# Altium schematic sheet Main_sch.SchDoc: Main_sch
size A3; Date: 2018/10/8; Author: Wang Peirong; Revision: V1.1; SheetNumber: 1; SheetTotal: Main schDoc; Size: A3; Pages: 6
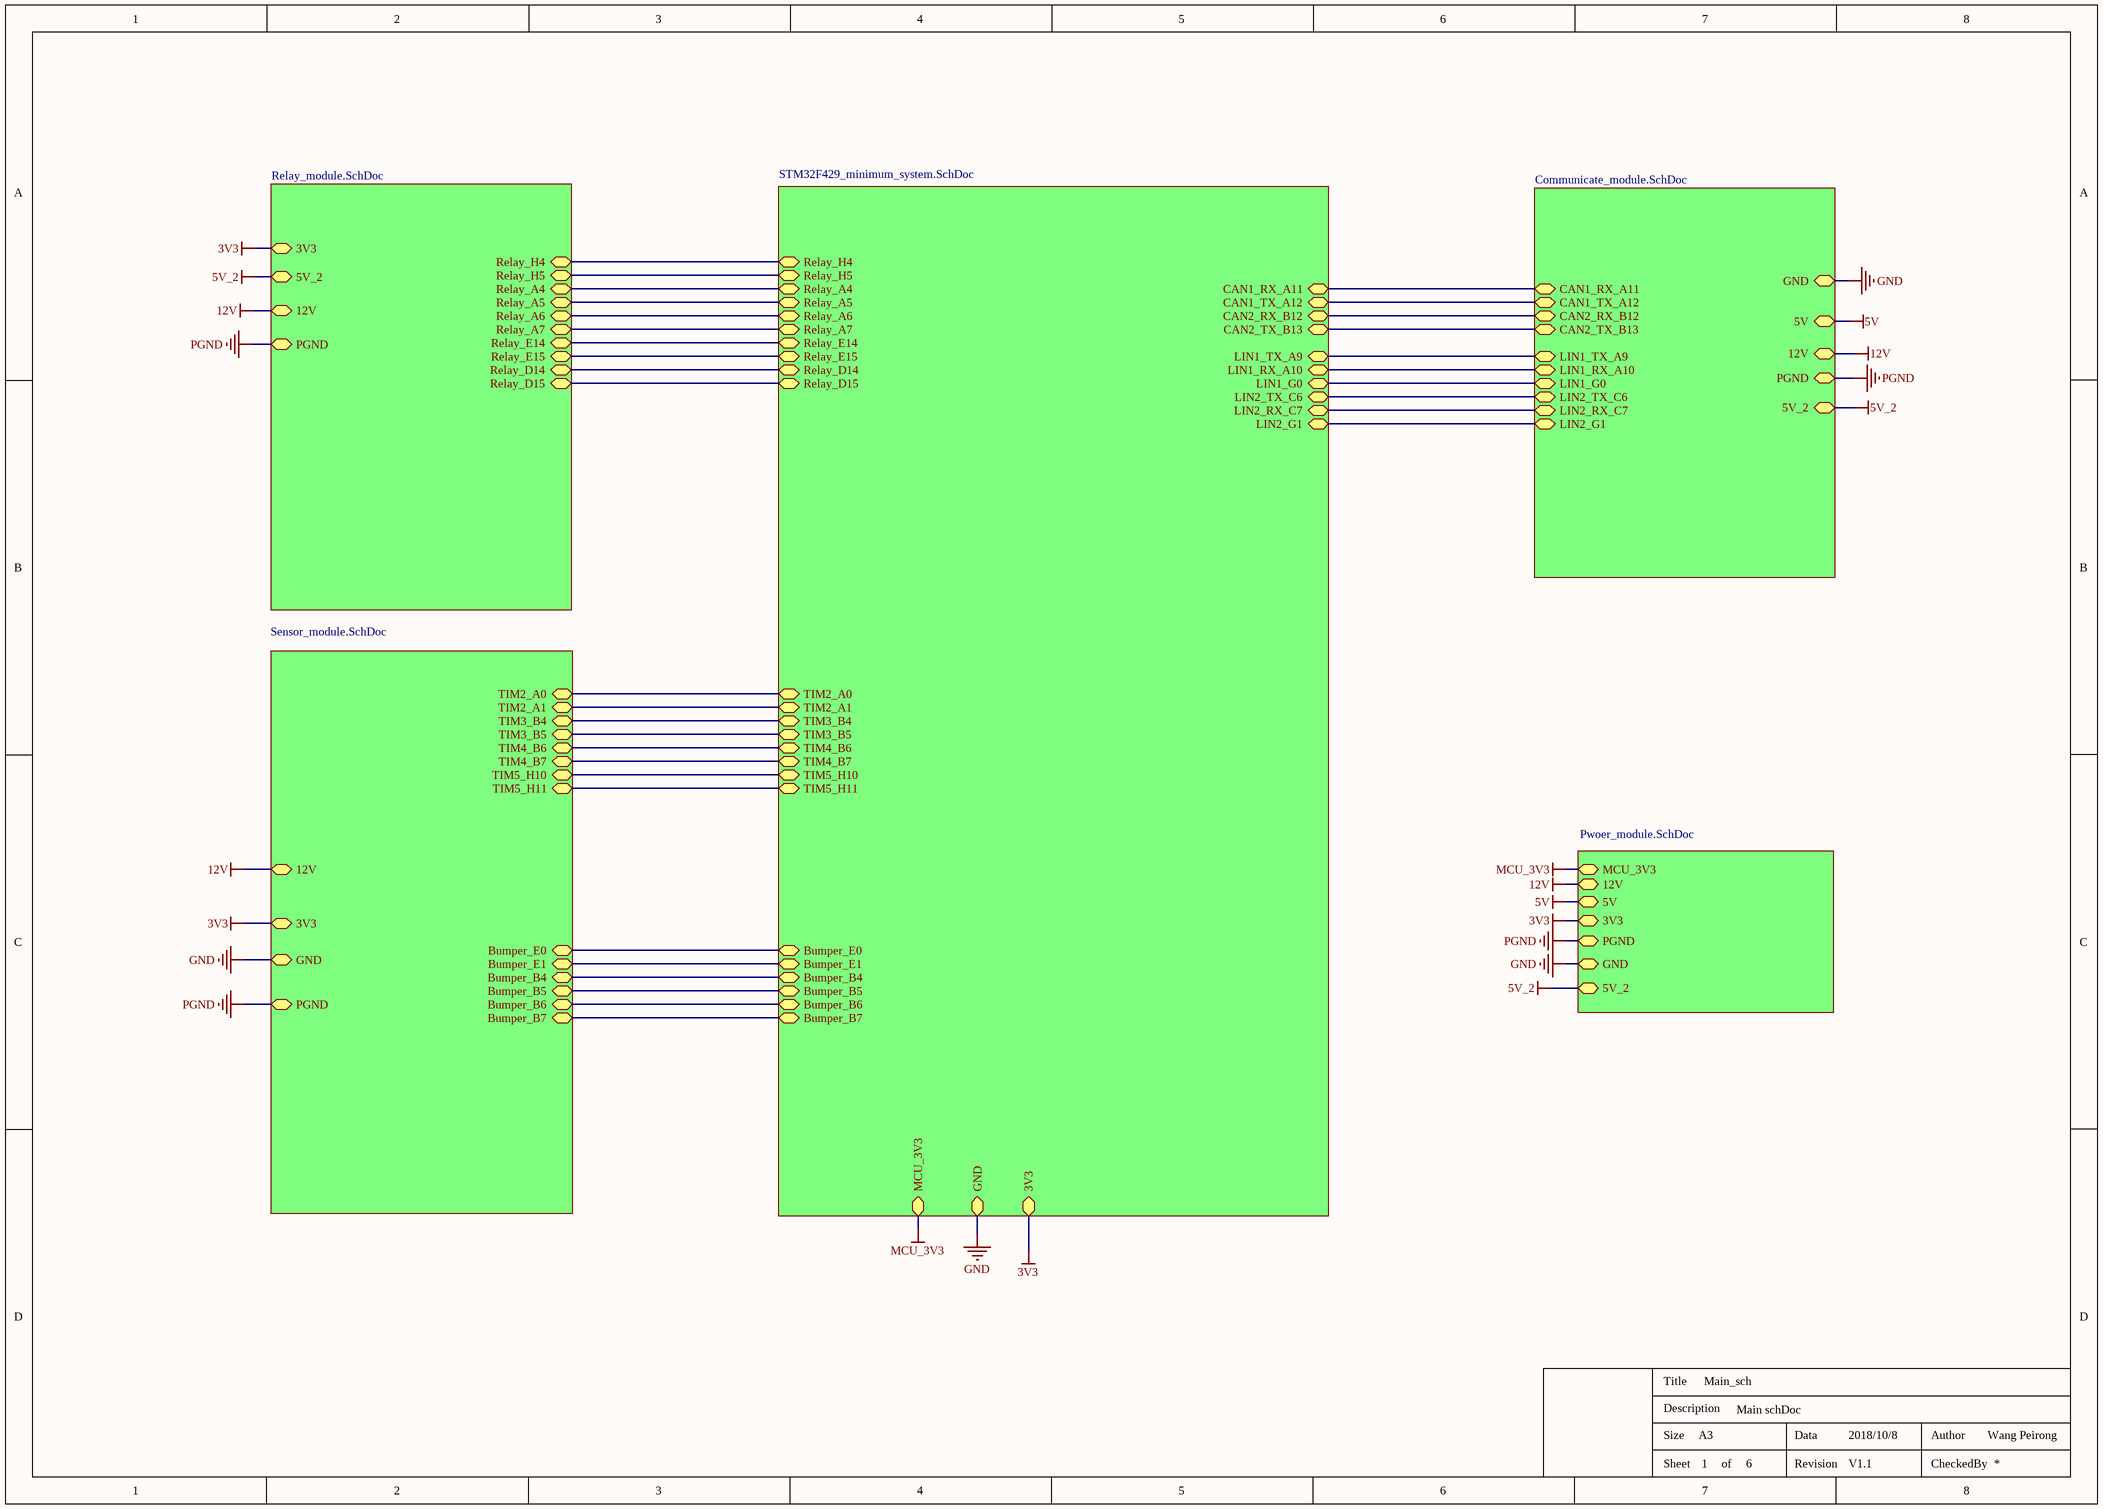
[diagram p0: Main_sch.SchDoc]

## Sub-sheets
? = Pwoer_module.SchDoc: 3V3, 12V, 5V, GND, PGND, 5V_2, MCU_3V3
? = Sensor_module.SchDoc: 12V, 3V3, GND, PGND, TIM2_A0, TIM2_A1, TIM3_B4, TIM3_B5, TIM4_B6, TIM4_B7, TIM5_H10, TIM5_H11, Bumper_E0, Bumper_E1, Bumper_B4, Bumper_B5, Bumper_B6, Bumper_B7
? = STM32F429_minimum_system.SchDoc: MCU_3V3, GND, CAN2_RX_B12, CAN2_TX_B13, CAN1_RX_A11, CAN1_TX_A12, TIM2_A0, TIM2_A1, TIM3_B4, TIM3_B5, TIM4_B6, TIM4_B7, TIM5_H10, TIM5_H11, Bumper_E0, Bumper_E1, Bumper_B4, Bumper_B5, Bumper_B6, Bumper_B7, Relay_H4, Relay_H5, Relay_A4, Relay_A5, Relay_A6, Relay_A7, Relay_E14, Relay_E15, LIN1_TX_A9, LIN1_RX_A10, LIN1_G0, LIN2_G1, LIN2_RX_C7, LIN2_TX_C6, Relay_D14, Relay_D15, 3V3
? = Relay_module.SchDoc: 3V3, 5V_2, 12V, PGND, Relay_H4, Relay_H5, Relay_A4, Relay_A5, Relay_A6, Relay_A7, Relay_E14, Relay_E15, Relay_D14, Relay_D15
? = Communicate_module.SchDoc: GND, 5V, CAN1_RX_A11, CAN1_TX_A12, CAN2_RX_B12, CAN2_TX_B13, 12V, PGND, LIN1_TX_A9, LIN1_RX_A10, 5V_2, LIN2_G1, LIN1_G0, LIN2_RX_C7, LIN2_TX_C6

## Nets
3V3: sheet /3V3, sheet /3V3, sheet /3V3, sheet /3V3
5V: sheet /5V, sheet /5V
5V_2: sheet /5V_2, sheet /5V_2, sheet /5V_2
12V: sheet /12V, sheet /12V, sheet /12V, sheet /12V
GND: sheet /GND, sheet /GND, sheet /GND, sheet /GND
MCU_3V3: sheet /MCU_3V3, sheet /MCU_3V3
PGND: sheet /PGND, sheet /PGND, sheet /PGND, sheet /PGND
(unnamed): sheet /TIM2_A0, sheet /TIM2_A0
(unnamed): sheet /TIM2_A1, sheet /TIM2_A1
(unnamed): sheet /TIM3_B4, sheet /TIM3_B4
(unnamed): sheet /TIM3_B5, sheet /TIM3_B5
(unnamed): sheet /TIM4_B6, sheet /TIM4_B6
(unnamed): sheet /TIM4_B7, sheet /TIM4_B7
(unnamed): sheet /TIM5_H10, sheet /TIM5_H10
(unnamed): sheet /TIM5_H11, sheet /TIM5_H11
(unnamed): sheet /Bumper_E0, sheet /Bumper_E0
(unnamed): sheet /Bumper_E1, sheet /Bumper_E1
(unnamed): sheet /Bumper_B4, sheet /Bumper_B4
(unnamed): sheet /Bumper_B5, sheet /Bumper_B5
(unnamed): sheet /Bumper_B6, sheet /Bumper_B6
(unnamed): sheet /Bumper_B7, sheet /Bumper_B7
(unnamed): sheet /CAN2_RX_B12, sheet /CAN2_RX_B12
(unnamed): sheet /CAN2_TX_B13, sheet /CAN2_TX_B13
(unnamed): sheet /CAN1_RX_A11, sheet /CAN1_RX_A11
(unnamed): sheet /CAN1_TX_A12, sheet /CAN1_TX_A12
(unnamed): sheet /Relay_H4, sheet /Relay_H4
(unnamed): sheet /Relay_H5, sheet /Relay_H5
(unnamed): sheet /Relay_A4, sheet /Relay_A4
(unnamed): sheet /Relay_A5, sheet /Relay_A5
(unnamed): sheet /Relay_A6, sheet /Relay_A6
(unnamed): sheet /Relay_A7, sheet /Relay_A7
(unnamed): sheet /Relay_E14, sheet /Relay_E14
(unnamed): sheet /Relay_E15, sheet /Relay_E15
(unnamed): sheet /LIN1_TX_A9, sheet /LIN1_TX_A9
(unnamed): sheet /LIN1_RX_A10, sheet /LIN1_RX_A10
(unnamed): sheet /LIN1_G0, sheet /LIN1_G0
(unnamed): sheet /LIN2_G1, sheet /LIN2_G1
(unnamed): sheet /LIN2_RX_C7, sheet /LIN2_RX_C7
(unnamed): sheet /LIN2_TX_C6, sheet /LIN2_TX_C6
(unnamed): sheet /Relay_D14, sheet /Relay_D14
(unnamed): sheet /Relay_D15, sheet /Relay_D15

## Notes on the sheet
- Title
- Description
- Size
- Data
- Author
- Sheet
- of
- Revision
- CheckedBy